# Altium schematic sheet PRUC-Voltmeter_FPGA-Power.SchDoc: Voltmeter / FPGA Power
size A4; SheetNumber: 9; SheetTotal: 9
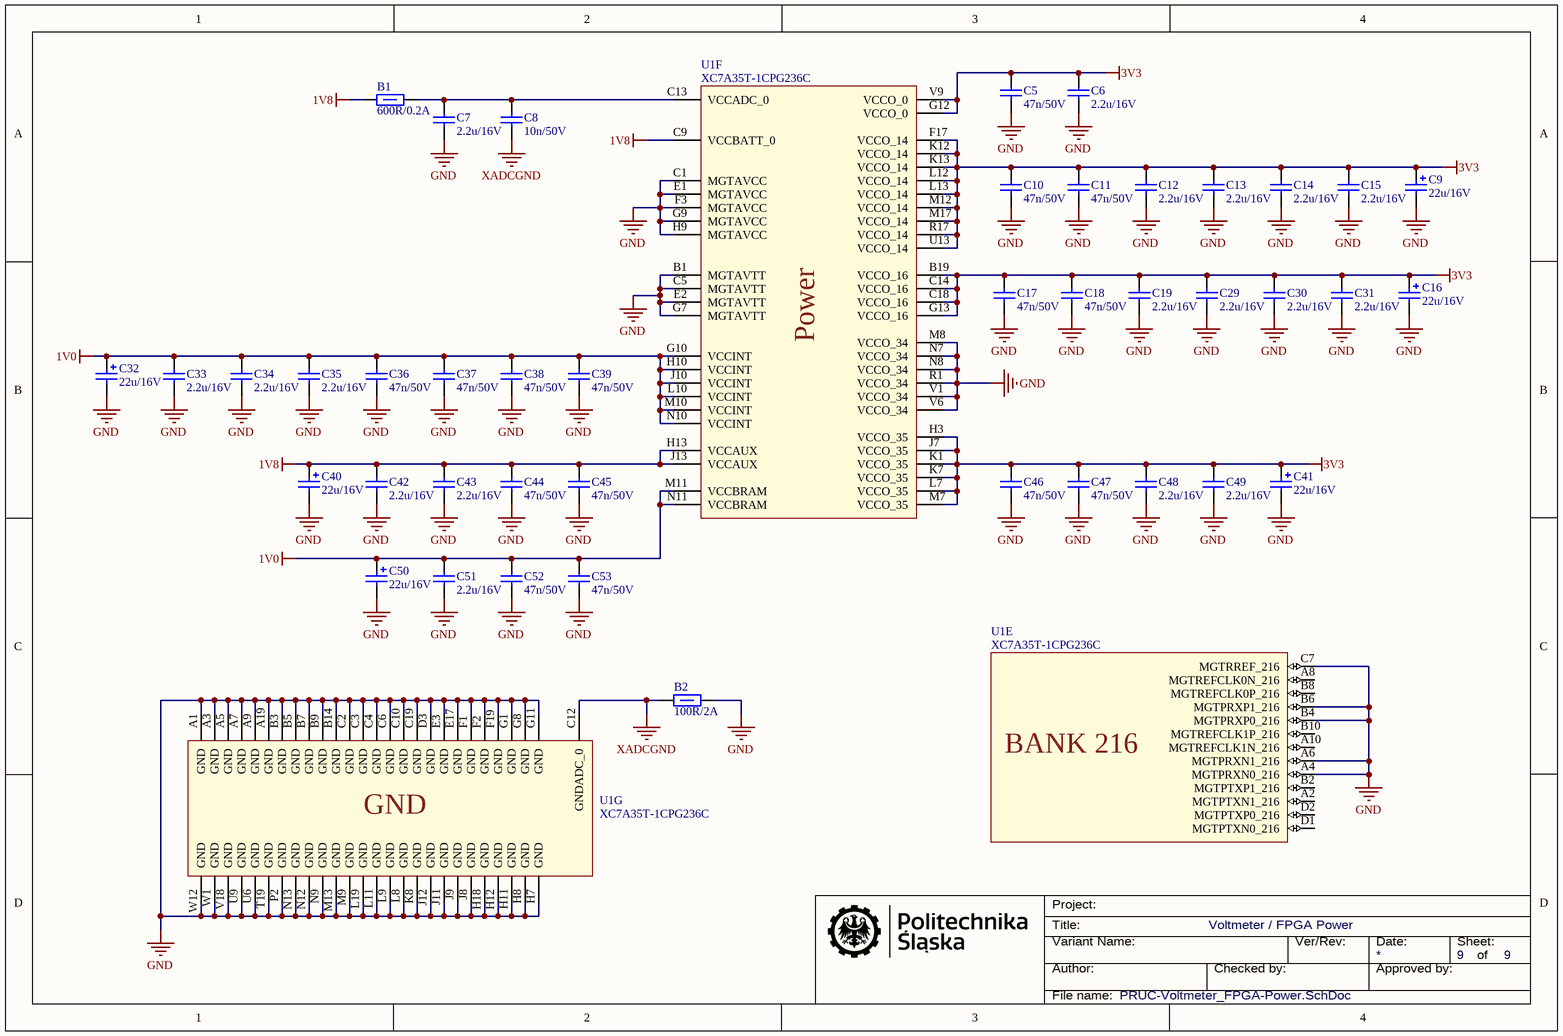
[diagram p0: PRUC-Voltmeter_FPGA-Power.SchDoc]

## Parts
B1  600R/0.2A  [FerriteBead_1206]
B2  100R/2A  [FerriteBead_0603]
C5  47n/50V  [MLCC_0603]
C6  2.2u/16V  [MLCC_0603]
C7  2.2u/16V  [MLCC_0603]
C8  10n/50V  [MLCC_0603]
C9  22u/16V  [Tantalum_B]
C10  47n/50V  [MLCC_0603]
C11  47n/50V  [MLCC_0603]
C12  2.2u/16V  [MLCC_0603]
C13  2.2u/16V  [MLCC_0603]
C14  2.2u/16V  [MLCC_0603]
C15  2.2u/16V  [MLCC_0603]
C16  22u/16V  [Tantalum_B]
C17  47n/50V  [MLCC_0603]
C18  47n/50V  [MLCC_0603]
C19  2.2u/16V  [MLCC_0603]
C29  2.2u/16V  [MLCC_0603]
C30  2.2u/16V  [MLCC_0603]
C31  2.2u/16V  [MLCC_0603]
C32  22u/16V  [Tantalum_B]
C33  2.2u/16V  [MLCC_0603]
C34  2.2u/16V  [MLCC_0603]
C35  2.2u/16V  [MLCC_0603]
C36  47n/50V  [MLCC_0603]
C37  47n/50V  [MLCC_0603]
C38  47n/50V  [MLCC_0603]
C39  47n/50V  [MLCC_0603]
C40  22u/16V  [Tantalum_B]
C41  22u/16V  [Tantalum_B]
C42  2.2u/16V  [MLCC_0603]
C43  2.2u/16V  [MLCC_0603]
C44  47n/50V  [MLCC_0603]
C45  47n/50V  [MLCC_0603]
C46  47n/50V  [MLCC_0603]
C47  47n/50V  [MLCC_0603]
C48  2.2u/16V  [MLCC_0603]
C49  2.2u/16V  [MLCC_0603]
C50  22u/16V  [Tantalum_B]
C51  2.2u/16V  [MLCC_0603]
C52  47n/50V  [MLCC_0603]
C53  47n/50V  [MLCC_0603]
U1  XC7A35T-1CPG236C  [CPG236-0.5mm]  (parts E,F,G of 8)

## Nets
1V0: C32.1 C33.1 C34.1 C35.1 C36.1 C37.1 C38.1 C39.1 C50.1 C51.1 C52.1 C53.1 U1.G10(VCCINT) U1.H10(VCCINT) U1.J10(VCCINT) U1.L10(VCCINT) U1.M10(VCCINT) U1.M11(VCCBRAM) U1.N10(VCCINT) U1.N11(VCCBRAM)
1V8: B1.2 C40.1 C42.1 C43.1 C44.1 C45.1 U1.C9(VCCBATT_0) U1.H13(VCCAUX) U1.J13(VCCAUX)
3V3: C5.1 C6.1 C9.1 C10.1 C11.1 C12.1 C13.1 C14.1 C15.1 C16.1 C17.1 C18.1 C19.1 C29.1 C30.1 C31.1 C41.1 C46.1 C47.1 C48.1 C49.1 U1.B19(VCCO_16) U1.C14(VCCO_16) U1.C18(VCCO_16) U1.F17(VCCO_14) U1.G12(VCCO_0) U1.G13(VCCO_16) U1.H3(VCCO_35) U1.J7(VCCO_35) U1.K1(VCCO_35) U1.K7(VCCO_35) U1.K12(VCCO_14) U1.K13(VCCO_14) U1.L7(VCCO_35) U1.L12(VCCO_14) U1.L13(VCCO_14) U1.M7(VCCO_35) U1.M12(VCCO_14) U1.M17(VCCO_14) U1.R17(VCCO_14) U1.U13(VCCO_14) U1.V9(VCCO_0)
GND: B2.2 C5.2 C6.2 C7.2 C9.2 C10.2 C11.2 C12.2 C13.2 C14.2 C15.2 C16.2 C17.2 C18.2 C19.2 C29.2 C30.2 C31.2 C32.2 C33.2 C34.2 C35.2 C36.2 C37.2 C38.2 C39.2 C40.2 C41.2 C42.2 C43.2 C44.2 C45.2 C46.2 C47.2 C48.2 C49.2 C50.2 C51.2 C52.2 C53.2 U1.A1(GND) U1.A3(GND) U1.A4(MGTPRXN0_216) U1.A5(GND) U1.A6(MGTPRXN1_216) U1.A7(GND) U1.A9(GND) U1.A19(GND) U1.B1(MGTAVTT) U1.B3(GND) U1.B4(MGTPRXP0_216) U1.B5(GND) U1.B6(MGTPRXP1_216) U1.B7(GND) U1.B9(GND) U1.B14(GND) U1.C1(MGTAVCC) U1.C2(GND) U1.C3(GND) U1.C4(GND) U1.C5(MGTAVTT) U1.C6(GND) U1.C7(MGTRREF_216) U1.C10(GND) U1.C19(GND) U1.D3(GND) U1.E1(MGTAVCC) U1.E2(MGTAVTT) U1.E3(GND) U1.E17(GND) U1.F1(GND) U1.F2(GND) U1.F3(MGTAVCC) U1.F19(GND) U1.G1(GND) U1.G7(MGTAVTT) U1.G8(GND) U1.G9(MGTAVCC) U1.G11(GND) U1.H7(GND) U1.H8(GND) U1.H9(MGTAVCC) U1.H11(GND) U1.H12(GND) U1.H18(GND) U1.J8(GND) U1.J9(GND) U1.J11(GND) U1.J12(GND) U1.K8(GND) U1.L8(GND) U1.L9(GND) U1.L11(GND) U1.L19(GND) U1.M8(VCCO_34) U1.M9(GND) U1.M13(GND) U1.N7(VCCO_34) U1.N8(VCCO_34) U1.N9(GND) U1.N12(GND) U1.N13(GND) U1.P2(GND) U1.R1(VCCO_34) U1.T19(GND) U1.U6(GND) U1.U9(GND) U1.V1(VCCO_34) U1.V6(VCCO_34) U1.V18(GND) U1.W1(GND) U1.W12(GND)
XADCGND: B2.1 C8.2 U1.C12(GNDADC_0)
NetB1_1: B1.1 C7.1 C8.1 U1.C13(VCCADC_0)

Not connected (* = marked no-connect by the designer): U1 A2(MGTPTXN1_216) A8(MGTREFCLK0N_216) A10(MGTREFCLK1N_216) B2(MGTPTXP1_216) B8(MGTREFCLK0P_216) B10(MGTREFCLK1P_216) D1(MGTPTXN0_216) D2(MGTPTXP0_216)

## Notes on the sheet
- Project:
- Title:
- Variant Name:
- Author:
- Checked by:
- Ver/Rev:
- Date:
- Approved by:
- Sheet:
- of
- File name:
- (in symbol XC7A35T-1CPG236C, part E) BANK 216
- (in symbol XC7A35T-1CPG236C, part F) Power

## Library data of the parts
B1 = BLM31A601SPT: Manufacturer: Murata; Manufacturer Part Number: BLM31AJ601SN1L; Part Description: Chip EMIFIL Inductor Type Chip Ferrite Beads; Index: 24; Part Number: BLM31A601SPT; Value: 600R/0.2A; SMD: true; Supplier 1: TME; Supplier Part Number 1: BLM31A601SPT; HelpURL: https://www.tme.eu/pl/Document/128ddfe20b0546871ca971b003a1b360/BLM31A260SPT-DTE.pdf; Category: Inductors
B2 = BLM18EG101TN1D: Manufacturer: Murata; Part Description: Chip EMIFIL Inductor Type Chip Ferrite Beads; Index: 30; Part Number: BLM18EG101TN1D; Value: 100R/2A; SMD: true; Manufacturer Part Number: BLM18EG101TN1D; Supplier 1: TME; Supplier Part Number 1: BLM18EG101TN1D; HelpURL: https://www.tme.eu/Document/f75b66d976bcb5ae8e5c98dcdbe6ac82/BLM18EG101TN1%23.pdf; Category: Inductors
C5 C10 C11 C17 C18 C36-C39 C44-C47 C52 C53 = CL10B473KB8NNNC: Manufacturer: Samsung; Part Description: 0603 General Multilayer Ceramic Capacitor; Index: 160; Part Number: CL10B473KB8NNNC; Value: 47n/50V; SMD: true; Manufacturer Part Number: CL10B473KB8NNNC; Supplier 1: TME; Supplier Part Number 1: CL10B473KB8NNNC; HelpURL: https://www.tme.eu/Document/4a42202b32dab16128fe107dd69598cc/samsung-chip-cap.pdf; Category: Capacitors
C6 C7 C12-C15 C19 C29-C31 C33-C35 C42 C43 C48 C49 C51 = CL10A225KO8NNNC: Manufacturer: Samsung; Part Description: 0603 General Multilayer Ceramic Capacitor; Index: 71; Part Number: CL10A225KO8NNNC; Value: 2.2u/16V; SMD: true; Manufacturer Part Number: CL10A225KO8NNNC; Supplier 1: TME; Supplier Part Number 1: CL10A225KO8NNNC; HelpURL: https://www.tme.eu/pl/Document/7da762c1dbaf553c64ad9c40d3603826/mlcc_samsung.pdf; Category: Capacitors
C8 = CL10B103KB8NNNC: Manufacturer: Samsung; Part Description: 0603 General Multilayer Ceramic Capacitor; Index: 29; Part Number: CL10B103KB8NNNC; Value: 10n/50V; SMD: true; Manufacturer Part Number: CL10B103KB8NNNC; Supplier 1: TME; Supplier Part Number 1: CL10B103KB8NNNC; HelpURL: https://www.tme.eu/pl/Document/7da762c1dbaf553c64ad9c40d3603826/mlcc_samsung.pdf; Category: Capacitors
C9 C16 C32 C40 C41 C50 = TAJB226K016R: Manufacturer: AVX; Manufacturer Part Number: TAJB226K016RNJ; Part Description: TAJ Series AVX Solid Tantalum Capacitor; Index: 23; Part Number: TAJB226K016R; Value: 22u/16V; SMD: true; Supplier 1: TME; Supplier Part Number 1: TAJB226K016R; HelpURL: https://www.tme.eu/pl/Document/85f84849ee9dc6997647a15c8c95a9d3/taj.pdf; Category: Capacitors
U1 = XC7A35T-1CPG236C: Manufacturer: Xilinx; Part Description: Xilinx 7 Series FPGA; Index: 159; Value: 33280 Cells; Part Number: XC7A35T-1CPG236C; SMD: true; Manufacturer Part Number: XC7A35T-1CPG236C; Supplier 1: Mouser; Supplier Part Number 1: 217-XC7A35T-1CPG236C; HelpURL: https://pl.mouser.com/datasheet/2/903/ds180_7Series_Overview-1591537.pdf; Category: FPGA